# Altium schematic sheet extio.SchDoc
size A2
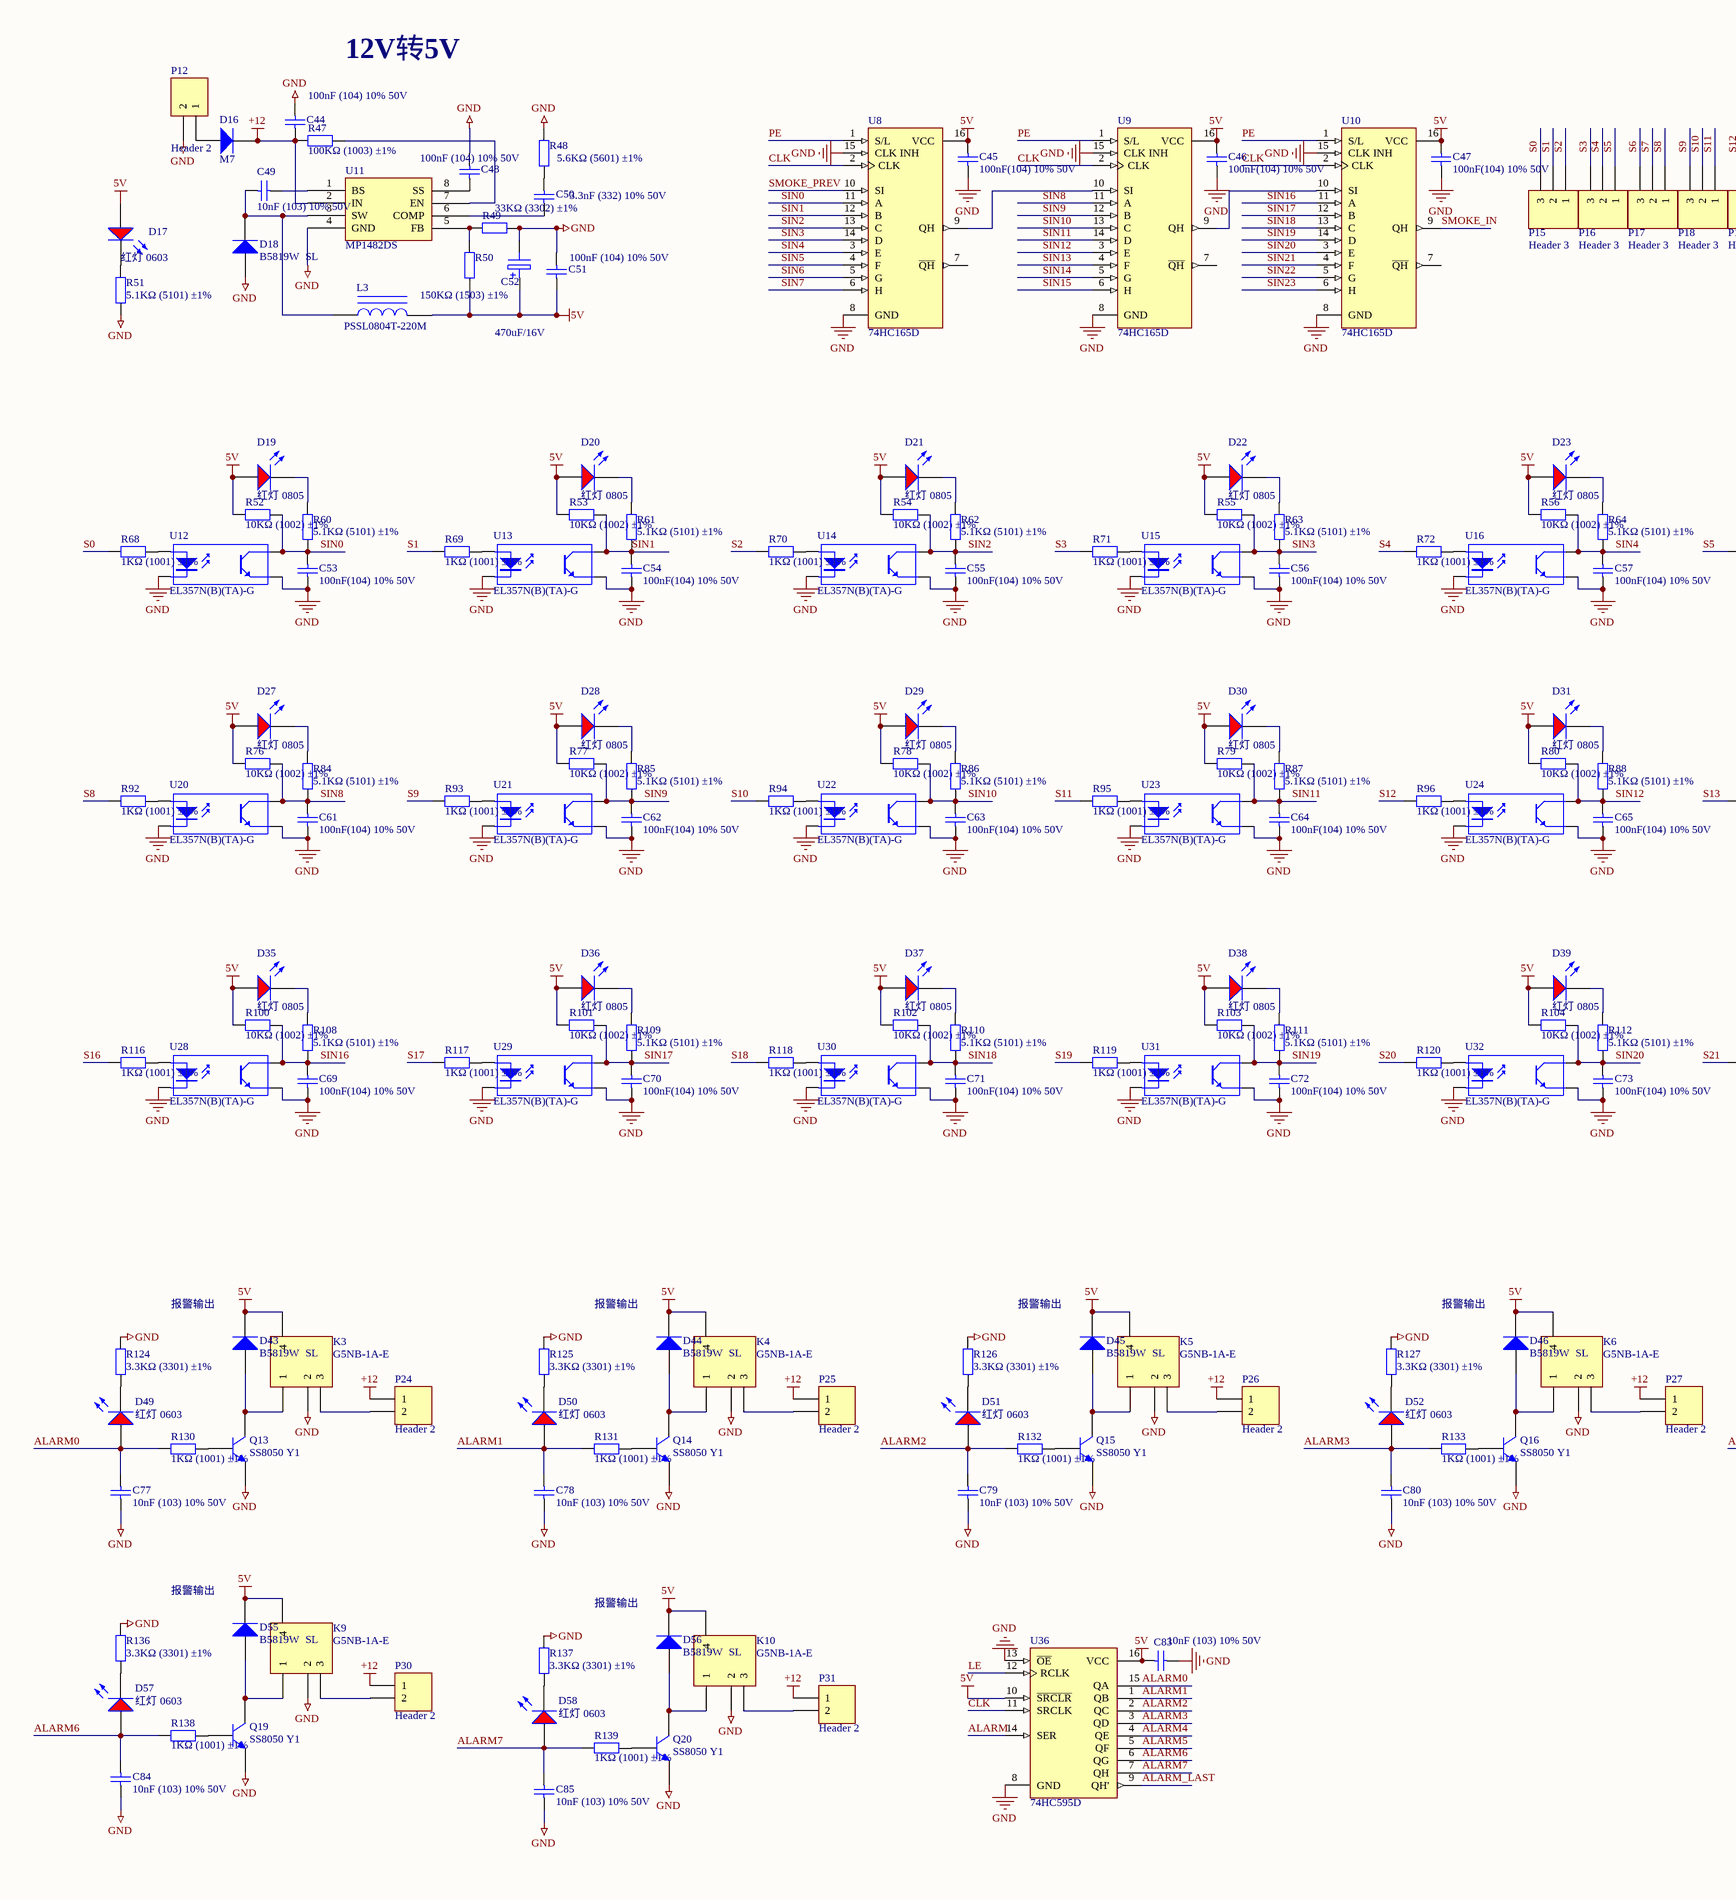
[diagram p0: extio.SchDoc, left]
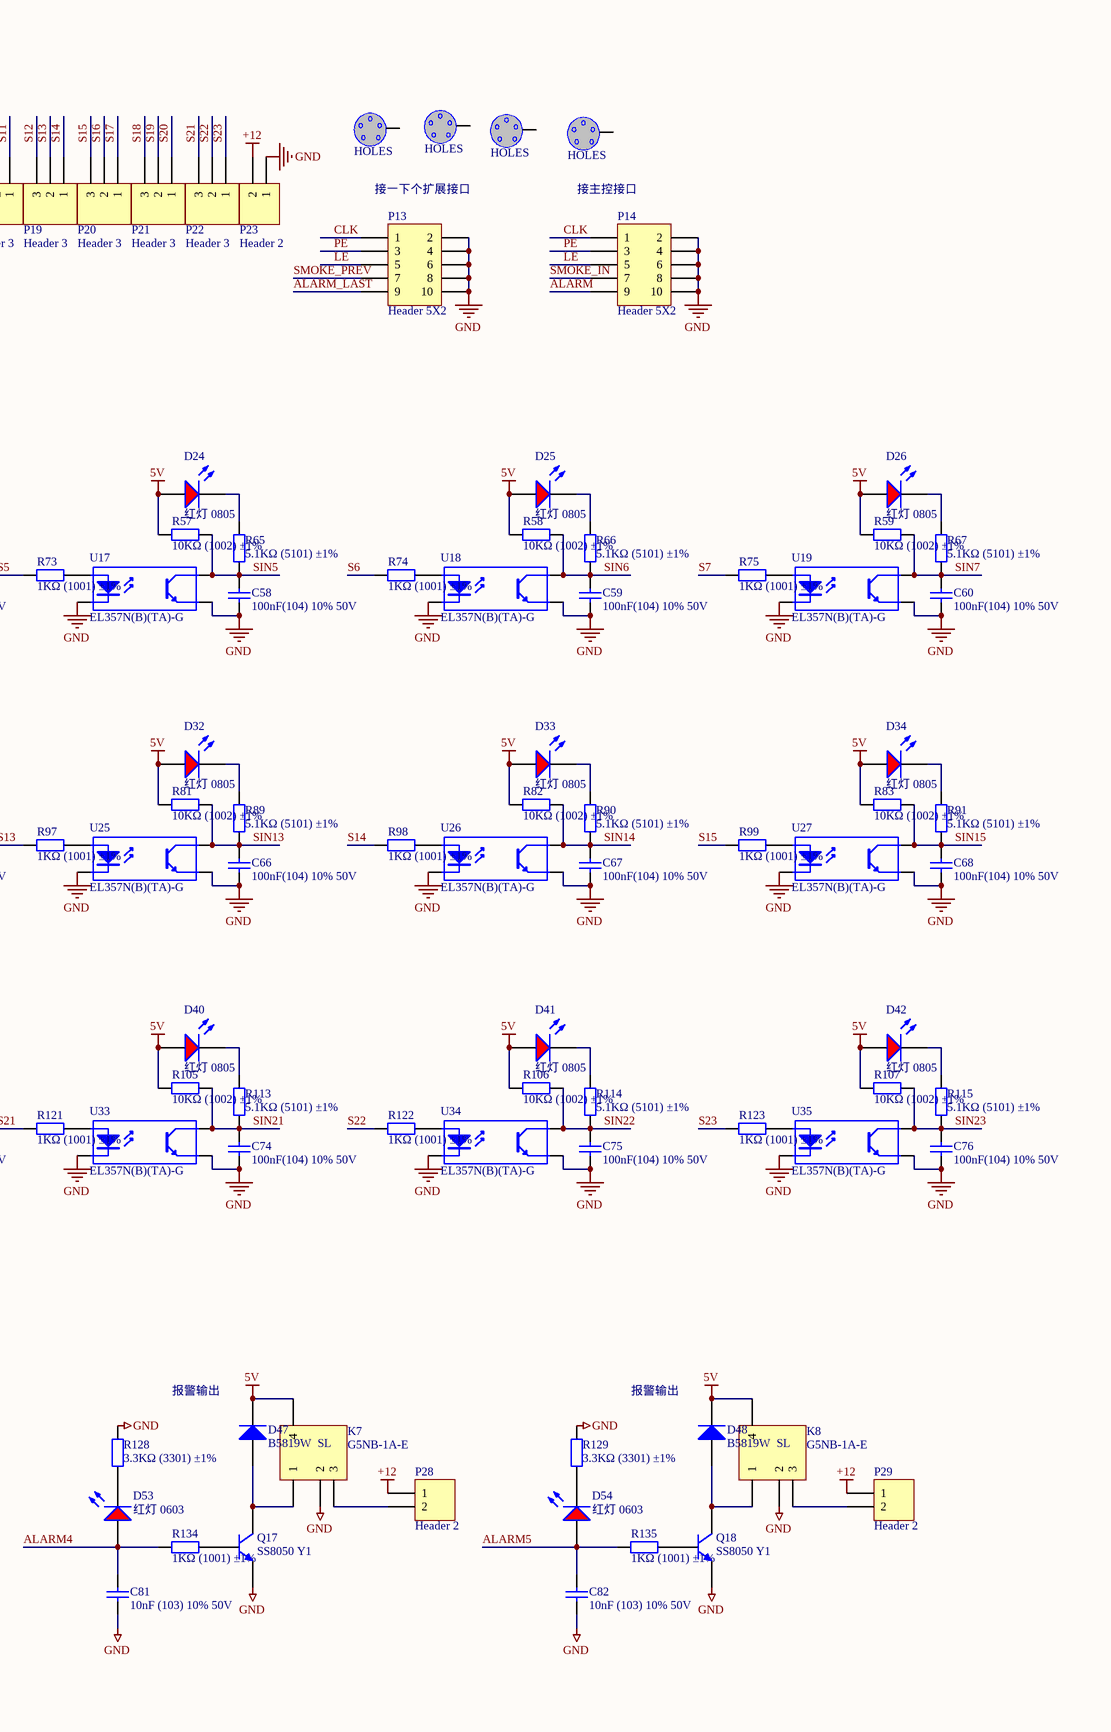
[diagram p1: extio.SchDoc, right]

## Parts
C44  100nF (104) 10% 50V  [0603_C]
C45  100nF(104) 10% 50V  [0805_C]
C46  100nF(104) 10% 50V  [0805_C]
C47  100nF(104) 10% 50V  [0805_C]
C48  100nF (104) 10% 50V  [0603_C]
C49  10nF (103) 10% 50V  [0603_C]
C50  3.3nF (332) 10% 50V  [0603_C]
C51  100nF (104) 10% 50V  [0603_C]
C52  470uF/16V  [153CLV-0810]
C53  100nF(104) 10% 50V  [0805_C]
C54  100nF(104) 10% 50V  [0805_C]
C55  100nF(104) 10% 50V  [0805_C]
C56  100nF(104) 10% 50V  [0805_C]
C57  100nF(104) 10% 50V  [0805_C]
C58  100nF(104) 10% 50V  [0805_C]
C59  100nF(104) 10% 50V  [0805_C]
C60  100nF(104) 10% 50V  [0805_C]
C61  100nF(104) 10% 50V  [0805_C]
C62  100nF(104) 10% 50V  [0805_C]
C63  100nF(104) 10% 50V  [0805_C]
C64  100nF(104) 10% 50V  [0805_C]
C65  100nF(104) 10% 50V  [0805_C]
C66  100nF(104) 10% 50V  [0805_C]
C67  100nF(104) 10% 50V  [0805_C]
C68  100nF(104) 10% 50V  [0805_C]
C69  100nF(104) 10% 50V  [0805_C]
C70  100nF(104) 10% 50V  [0805_C]
C71  100nF(104) 10% 50V  [0805_C]
C72  100nF(104) 10% 50V  [0805_C]
C73  100nF(104) 10% 50V  [0805_C]
C74  100nF(104) 10% 50V  [0805_C]
C75  100nF(104) 10% 50V  [0805_C]
C76  100nF(104) 10% 50V  [0805_C]
C77  10nF (103) 10% 50V  [0603_C]
C78  10nF (103) 10% 50V  [0603_C]
C79  10nF (103) 10% 50V  [0603_C]
C80  10nF (103) 10% 50V  [0603_C]
C81  10nF (103) 10% 50V  [0603_C]
C82  10nF (103) 10% 50V  [0603_C]
C83  10nF (103) 10% 50V  [0603_C]
C84  10nF (103) 10% 50V  [0603_C]
C85  10nF (103) 10% 50V  [0603_C]
D16  M7  [SMA(DO-214AC)_S1]
D17  红灯 0603  [0603_LED_S1]
D18  B5819W  SL  [SOD-123]
D19  红灯 0805  [0805_LED_S1]
D20  红灯 0805  [0805_LED_S1]
D21  红灯 0805  [0805_LED_S1]
D22  红灯 0805  [0805_LED_S1]
D23  红灯 0805  [0805_LED_S1]
D24  红灯 0805  [0805_LED_S1]
D25  红灯 0805  [0805_LED_S1]
D26  红灯 0805  [0805_LED_S1]
D27  红灯 0805  [0805_LED_S1]
D28  红灯 0805  [0805_LED_S1]
D29  红灯 0805  [0805_LED_S1]
D30  红灯 0805  [0805_LED_S1]
D31  红灯 0805  [0805_LED_S1]
D32  红灯 0805  [0805_LED_S1]
D33  红灯 0805  [0805_LED_S1]
D34  红灯 0805  [0805_LED_S1]
D35  红灯 0805  [0805_LED_S1]
D36  红灯 0805  [0805_LED_S1]
D37  红灯 0805  [0805_LED_S1]
D38  红灯 0805  [0805_LED_S1]
D39  红灯 0805  [0805_LED_S1]
D40  红灯 0805  [0805_LED_S1]
D41  红灯 0805  [0805_LED_S1]
D42  红灯 0805  [0805_LED_S1]
D43  B5819W  SL  [SOD-123]
D44  B5819W  SL  [SOD-123]
D45  B5819W  SL  [SOD-123]
D46  B5819W  SL  [SOD-123]
D47  B5819W  SL  [SOD-123]
D48  B5819W  SL  [SOD-123]
D49  红灯 0603  [0603_LED_S1]
D50  红灯 0603  [0603_LED_S1]
D51  红灯 0603  [0603_LED_S1]
D52  红灯 0603  [0603_LED_S1]
D53  红灯 0603  [0603_LED_S1]
D54  红灯 0603  [0603_LED_S1]
D55  B5819W  SL  [SOD-123]
D56  B5819W  SL  [SOD-123]
D57  红灯 0603  [0603_LED_S1]
D58  红灯 0603  [0603_LED_S1]
HOLES1  HOLES  [HOLES]
HOLES2  HOLES  [HOLES]
HOLES3  HOLES  [HOLES]
HOLES4  HOLES  [HOLES]
K3  G5NB-1A-E  [G5NB-1A]
K4  G5NB-1A-E  [G5NB-1A]
K5  G5NB-1A-E  [G5NB-1A]
K6  G5NB-1A-E  [G5NB-1A]
K7  G5NB-1A-E  [G5NB-1A]
K8  G5NB-1A-E  [G5NB-1A]
K9  G5NB-1A-E  [G5NB-1A]
K10  G5NB-1A-E  [G5NB-1A]
L3  PSSL0804T-220M  [L7-8]
P12  Header 2  [KF396-2P]
P13  Header 5X2  [ML10]
P14  Header 5X2  [ML10]
P15  Header 3  [KF396-3P]
P16  Header 3  [KF396-3P]
P17  Header 3  [KF396-3P]
P18  Header 3  [KF396-3P]
P19  Header 3  [KF396-3P]
P20  Header 3  [KF396-3P]
P21  Header 3  [KF396-3P]
P22  Header 3  [KF396-3P]
P23  Header 2  [KF396-2P]
P24  Header 2  [KF396-2P]
P25  Header 2  [KF396-2P]
P26  Header 2  [KF396-2P]
P27  Header 2  [KF396-2P]
P28  Header 2  [KF396-2P]
P29  Header 2  [KF396-2P]
P30  Header 2  [KF396-2P]
P31  Header 2  [KF396-2P]
Q13  SS8050 Y1  [SOT-23(SOT-23-3)]
Q14  SS8050 Y1  [SOT-23(SOT-23-3)]
Q15  SS8050 Y1  [SOT-23(SOT-23-3)]
Q16  SS8050 Y1  [SOT-23(SOT-23-3)]
Q17  SS8050 Y1  [SOT-23(SOT-23-3)]
Q18  SS8050 Y1  [SOT-23(SOT-23-3)]
Q19  SS8050 Y1  [SOT-23(SOT-23-3)]
Q20  SS8050 Y1  [SOT-23(SOT-23-3)]
R47  100KΩ (1003) ±1%  [0603_R]
R48  5.6KΩ (5601) ±1%  [0603_R]
R49  33KΩ (3302) ±1%  [0603_R]
R50  150KΩ (1503) ±1%  [0603_R]
R51  5.1KΩ (5101) ±1%  [0805_R]
R52  10KΩ (1002) ±1%  [0805_R]
R53  10KΩ (1002) ±1%  [0805_R]
R54  10KΩ (1002) ±1%  [0805_R]
R55  10KΩ (1002) ±1%  [0805_R]
R56  10KΩ (1002) ±1%  [0805_R]
R57  10KΩ (1002) ±1%  [0805_R]
R58  10KΩ (1002) ±1%  [0805_R]
R59  10KΩ (1002) ±1%  [0805_R]
R60  5.1KΩ (5101) ±1%  [0805_R]
R61  5.1KΩ (5101) ±1%  [0805_R]
R62  5.1KΩ (5101) ±1%  [0805_R]
R63  5.1KΩ (5101) ±1%  [0805_R]
R64  5.1KΩ (5101) ±1%  [0805_R]
R65  5.1KΩ (5101) ±1%  [0805_R]
R66  5.1KΩ (5101) ±1%  [0805_R]
R67  5.1KΩ (5101) ±1%  [0805_R]
R68  1KΩ (1001) ±1%  [0805_R]
R69  1KΩ (1001) ±1%  [0805_R]
R70  1KΩ (1001) ±1%  [0805_R]
R71  1KΩ (1001) ±1%  [0805_R]
R72  1KΩ (1001) ±1%  [0805_R]
R73  1KΩ (1001) ±1%  [0805_R]
R74  1KΩ (1001) ±1%  [0805_R]
R75  1KΩ (1001) ±1%  [0805_R]
R76  10KΩ (1002) ±1%  [0805_R]
R77  10KΩ (1002) ±1%  [0805_R]
R78  10KΩ (1002) ±1%  [0805_R]
R79  10KΩ (1002) ±1%  [0805_R]
R80  10KΩ (1002) ±1%  [0805_R]
R81  10KΩ (1002) ±1%  [0805_R]
R82  10KΩ (1002) ±1%  [0805_R]
R83  10KΩ (1002) ±1%  [0805_R]
R84  5.1KΩ (5101) ±1%  [0805_R]
R85  5.1KΩ (5101) ±1%  [0805_R]
R86  5.1KΩ (5101) ±1%  [0805_R]
R87  5.1KΩ (5101) ±1%  [0805_R]
R88  5.1KΩ (5101) ±1%  [0805_R]
R89  5.1KΩ (5101) ±1%  [0805_R]
R90  5.1KΩ (5101) ±1%  [0805_R]
R91  5.1KΩ (5101) ±1%  [0805_R]
R92  1KΩ (1001) ±1%  [0805_R]
R93  1KΩ (1001) ±1%  [0805_R]
R94  1KΩ (1001) ±1%  [0805_R]
R95  1KΩ (1001) ±1%  [0805_R]
R96  1KΩ (1001) ±1%  [0805_R]
R97  1KΩ (1001) ±1%  [0805_R]
R98  1KΩ (1001) ±1%  [0805_R]
R99  1KΩ (1001) ±1%  [0805_R]
R100  10KΩ (1002) ±1%  [0805_R]
R101  10KΩ (1002) ±1%  [0805_R]
R102  10KΩ (1002) ±1%  [0805_R]
R103  10KΩ (1002) ±1%  [0805_R]
R104  10KΩ (1002) ±1%  [0805_R]
R105  10KΩ (1002) ±1%  [0805_R]
R106  10KΩ (1002) ±1%  [0805_R]
R107  10KΩ (1002) ±1%  [0805_R]
R108  5.1KΩ (5101) ±1%  [0805_R]
R109  5.1KΩ (5101) ±1%  [0805_R]
R110  5.1KΩ (5101) ±1%  [0805_R]
R111  5.1KΩ (5101) ±1%  [0805_R]
R112  5.1KΩ (5101) ±1%  [0805_R]
R113  5.1KΩ (5101) ±1%  [0805_R]
R114  5.1KΩ (5101) ±1%  [0805_R]
R115  5.1KΩ (5101) ±1%  [0805_R]
R116  1KΩ (1001) ±1%  [0805_R]
R117  1KΩ (1001) ±1%  [0805_R]
R118  1KΩ (1001) ±1%  [0805_R]
R119  1KΩ (1001) ±1%  [0805_R]
R120  1KΩ (1001) ±1%  [0805_R]
R121  1KΩ (1001) ±1%  [0805_R]
R122  1KΩ (1001) ±1%  [0805_R]
R123  1KΩ (1001) ±1%  [0805_R]
R124  3.3KΩ (3301) ±1%  [0603_R]
R125  3.3KΩ (3301) ±1%  [0603_R]
R126  3.3KΩ (3301) ±1%  [0603_R]
R127  3.3KΩ (3301) ±1%  [0603_R]
R128  3.3KΩ (3301) ±1%  [0603_R]
R129  3.3KΩ (3301) ±1%  [0603_R]
R130  1KΩ (1001) ±1%  [0603_R]
R131  1KΩ (1001) ±1%  [0603_R]
R132  1KΩ (1001) ±1%  [0603_R]
R133  1KΩ (1001) ±1%  [0603_R]
R134  1KΩ (1001) ±1%  [0603_R]
R135  1KΩ (1001) ±1%  [0603_R]
R136  3.3KΩ (3301) ±1%  [0603_R]
R137  3.3KΩ (3301) ±1%  [0603_R]
R138  1KΩ (1001) ±1%  [0603_R]
R139  1KΩ (1001) ±1%  [0603_R]
U8  74HC165D  [SOIC-16_150mil]
U9  74HC165D  [SOIC-16_150mil]
U10  74HC165D  [SOIC-16_150mil]
U11  MP1482DS  [SOIC-8_150mil]
U12  EL357N(B)(TA)-G  [SOP-4_P2.54]
U13  EL357N(B)(TA)-G  [SOP-4_P2.54]
U14  EL357N(B)(TA)-G  [SOP-4_P2.54]
U15  EL357N(B)(TA)-G  [SOP-4_P2.54]
U16  EL357N(B)(TA)-G  [SOP-4_P2.54]
U17  EL357N(B)(TA)-G  [SOP-4_P2.54]
U18  EL357N(B)(TA)-G  [SOP-4_P2.54]
U19  EL357N(B)(TA)-G  [SOP-4_P2.54]
U20  EL357N(B)(TA)-G  [SOP-4_P2.54]
U21  EL357N(B)(TA)-G  [SOP-4_P2.54]
U22  EL357N(B)(TA)-G  [SOP-4_P2.54]
U23  EL357N(B)(TA)-G  [SOP-4_P2.54]
U24  EL357N(B)(TA)-G  [SOP-4_P2.54]
U25  EL357N(B)(TA)-G  [SOP-4_P2.54]
U26  EL357N(B)(TA)-G  [SOP-4_P2.54]
U27  EL357N(B)(TA)-G  [SOP-4_P2.54]
U28  EL357N(B)(TA)-G  [SOP-4_P2.54]
U29  EL357N(B)(TA)-G  [SOP-4_P2.54]
U30  EL357N(B)(TA)-G  [SOP-4_P2.54]
U31  EL357N(B)(TA)-G  [SOP-4_P2.54]
U32  EL357N(B)(TA)-G  [SOP-4_P2.54]
U33  EL357N(B)(TA)-G  [SOP-4_P2.54]
U34  EL357N(B)(TA)-G  [SOP-4_P2.54]
U35  EL357N(B)(TA)-G  [SOP-4_P2.54]
U36  74HC595D  [SOIC-16_150mil]

## Nets
5V: C45.1 C46.1 C47.1 C51.1 C52.1 C83.1 D17.A D19.A D20.A D21.A D22.A D23.A D24.A D25.A D26.A D27.A D28.A D29.A D30.A D31.A D32.A D33.A D34.A D35.A D36.A D37.A D38.A D39.A D40.A D41.A D42.A D43.2(K) D44.2(K) D45.2(K) D46.2(K) D47.2(K) D48.2(K) D55.2(K) D56.2(K) K3.4 K4.4 K5.4 K6.4 K7.4 K8.4 K9.4 K10.4 L3.2 R50.2 R52.2 R53.2 R54.2 R55.2 R56.2 R57.2 R58.2 R59.2 R76.2 R77.2 R78.2 R79.2 R80.2 R81.2 R82.2 R83.2 R100.2 R101.2 R102.2 R103.2 R104.2 R105.2 R106.2 R107.2 U8.16(VCC) U9.16(VCC) U10.16(VCC) U36.10(~{SRCLR}) U36.16(VCC)
+12: C44.2 D16.2(K) P23.2 P24.1 P25.1 P26.1 P27.1 P28.1 P29.1 P30.1 P31.1 R47.1 U11.2(IN)
GND: C44.1 C45.2 C46.2 C47.2 C48.1 C51.2 C52.2 C53.2 C54.2 C55.2 C56.2 C57.2 C58.2 C59.2 C60.2 C61.2 C62.2 C63.2 C64.2 C65.2 C66.2 C67.2 C68.2 C69.2 C70.2 C71.2 C72.2 C73.2 C74.2 C75.2 C76.2 C77.2 C78.2 C79.2 C80.2 C81.2 C82.2 C83.2 C84.2 C85.2 D18.1(A) K3.2 K4.2 K5.2 K6.2 K7.2 K8.2 K9.2 K10.2 P12.2 P13.2 P13.4 P13.6 P13.8 P13.10 P14.2 P14.4 P14.6 P14.8 P14.10 P23.1 Q13.2(E) Q14.2(E) Q15.2(E) Q16.2(E) Q17.2(E) Q18.2(E) Q19.2(E) Q20.2(E) R48.2 R49.2 R51.2 R124.1 R125.1 R126.1 R127.1 R128.1 R129.1 R136.1 R137.1 U8.8(GND) U8.15(CLK_INH) U9.8(GND) U9.15(CLK_INH) U10.8(GND) U10.15(CLK_INH) U11.4(GND) U12.2(K) U12.3(E) U13.2(K) U13.3(E) U14.2(K) U14.3(E) U15.2(K) U15.3(E) U16.2(K) U16.3(E) U17.2(K) U17.3(E) U18.2(K) U18.3(E) U19.2(K) U19.3(E) U20.2(K) U20.3(E) U21.2(K) U21.3(E) U22.2(K) U22.3(E) U23.2(K) U23.3(E) U24.2(K) U24.3(E) U25.2(K) U25.3(E) U26.2(K) U26.3(E) U27.2(K) U27.3(E) U28.2(K) U28.3(E) U29.2(K) U29.3(E) U30.2(K) U30.3(E) U31.2(K) U31.3(E) U32.2(K) U32.3(E) U33.2(K) U33.3(E) U34.2(K) U34.3(E) U35.2(K) U35.3(E) U36.8(GND) U36.13(~{OE})
ALARM: P14.9 U36.14(SER)
ALARM0: C77.1 D49.A R130.1 U36.15(QA)
ALARM1: C78.1 D50.A R131.1 U36.1(QB)
ALARM2: C79.1 D51.A R132.1 U36.2(QC)
ALARM3: C80.1 D52.A R133.1 U36.3(QD)
ALARM4: C81.1 D53.A R134.1 U36.4(QE)
ALARM5: C82.1 D54.A R135.1 U36.5(QF)
ALARM6: C84.1 D57.A R138.1 U36.6(QG)
ALARM7: C85.1 D58.A R139.1 U36.7(QH)
ALARM_LAST: P13.9 U36.9(QH')
CLK: P13.1 P14.1 U8.2(CLK) U9.2(CLK) U10.2(CLK) U36.11(SRCLK)
LE: P13.5 P14.5 U36.12(RCLK)
PE: P13.3 P14.3 U8.1(S/L) U9.1(S/L) U10.1(S/L)
S0: P15.3 R68.1
S1: P15.2 R69.1
S2: P15.1 R70.1
S3: P16.3 R71.1
S4: P16.2 R72.1
S5: P16.1 R73.1
S6: P17.3 R74.1
S7: P17.2 R75.1
S8: P17.1 R92.1
S9: P18.3 R93.1
S10: P18.2 R94.1
S11: P18.1 R95.1
S12: P19.3 R96.1
S13: P19.2 R97.1
S14: P19.1 R98.1
S15: P20.3 R99.1
S16: P20.2 R116.1
S17: P20.1 R117.1
S18: P21.3 R118.1
S19: P21.2 R119.1
S20: P21.1 R120.1
S21: P22.3 R121.1
S22: P22.2 R122.1
S23: P22.1 R123.1
SIN0: C53.1 R52.1 R60.2 U8.11(A) U12.4(C)
SIN1: C54.1 R53.1 R61.2 U8.12(B) U13.4(C)
SIN2: C55.1 R54.1 R62.2 U8.13(C) U14.4(C)
SIN3: C56.1 R55.1 R63.2 U8.14(D) U15.4(C)
SIN4: C57.1 R56.1 R64.2 U8.3(E) U16.4(C)
SIN5: C58.1 R57.1 R65.2 U8.4(F) U17.4(C)
SIN6: C59.1 R58.1 R66.2 U8.5(G) U18.4(C)
SIN7: C60.1 R59.1 R67.2 U8.6(H) U19.4(C)
SIN8: C61.1 R76.1 R84.2 U9.11(A) U20.4(C)
SIN9: C62.1 R77.1 R85.2 U9.12(B) U21.4(C)
SIN10: C63.1 R78.1 R86.2 U9.13(C) U22.4(C)
SIN11: C64.1 R79.1 R87.2 U9.14(D) U23.4(C)
SIN12: C65.1 R80.1 R88.2 U9.3(E) U24.4(C)
SIN13: C66.1 R81.1 R89.2 U9.4(F) U25.4(C)
SIN14: C67.1 R82.1 R90.2 U9.5(G) U26.4(C)
SIN15: C68.1 R83.1 R91.2 U9.6(H) U27.4(C)
SIN16: C69.1 R100.1 R108.2 U10.11(A) U28.4(C)
SIN17: C70.1 R101.1 R109.2 U10.12(B) U29.4(C)
SIN18: C71.1 R102.1 R110.2 U10.13(C) U30.4(C)
SIN19: C72.1 R103.1 R111.2 U10.14(D) U31.4(C)
SIN20: C73.1 R104.1 R112.2 U10.3(E) U32.4(C)
SIN21: C74.1 R105.1 R113.2 U10.4(F) U33.4(C)
SIN22: C75.1 R106.1 R114.2 U10.5(G) U34.4(C)
SIN23: C76.1 R107.1 R115.2 U10.6(H) U35.4(C)
SMOKE_IN: P14.7 U10.9(QH)
SMOKE_PREV: P13.7 U8.10(SI)
NetC48_2: C48.2 U11.8(SS)
NetC49_1: C49.1 D18.2(K) L3.1 U11.3(SW)
NetC49_2: C49.2 U11.1(BS)
NetC50_1: C50.1 R48.1
NetC50_2: C50.2 U11.6(COMP)
NetD16_1: D16.1(A) P12.1
NetD17_K: D17.K R51.1
NetD19_K: D19.K R60.1
NetD20_K: D20.K R61.1
NetD21_K: D21.K R62.1
NetD22_K: D22.K R63.1
NetD23_K: D23.K R64.1
NetD24_K: D24.K R65.1
NetD25_K: D25.K R66.1
NetD26_K: D26.K R67.1
NetD27_K: D27.K R84.1
NetD28_K: D28.K R85.1
NetD29_K: D29.K R86.1
NetD30_K: D30.K R87.1
NetD31_K: D31.K R88.1
NetD32_K: D32.K R89.1
NetD33_K: D33.K R90.1
NetD34_K: D34.K R91.1
NetD35_K: D35.K R108.1
NetD36_K: D36.K R109.1
NetD37_K: D37.K R110.1
NetD38_K: D38.K R111.1
NetD39_K: D39.K R112.1
NetD40_K: D40.K R113.1
NetD41_K: D41.K R114.1
NetD42_K: D42.K R115.1
NetD43_1: D43.1(A) K3.1 Q13.3(C)
NetD44_1: D44.1(A) K4.1 Q14.3(C)
NetD45_1: D45.1(A) K5.1 Q15.3(C)
NetD46_1: D46.1(A) K6.1 Q16.3(C)
NetD47_1: D47.1(A) K7.1 Q17.3(C)
NetD48_1: D48.1(A) K8.1 Q18.3(C)
NetD49_K: D49.K R124.2
NetD50_K: D50.K R125.2
NetD51_K: D51.K R126.2
NetD52_K: D52.K R127.2
NetD53_K: D53.K R128.2
NetD54_K: D54.K R129.2
NetD55_1: D55.1(A) K9.1 Q19.3(C)
NetD56_1: D56.1(A) K10.1 Q20.3(C)
NetD57_K: D57.K R136.2
NetD58_K: D58.K R137.2
NetK3_3: K3.3 P24.2
NetK4_3: K4.3 P25.2
NetK5_3: K5.3 P26.2
NetK6_3: K6.3 P27.2
NetK7_3: K7.3 P28.2
NetK8_3: K8.3 P29.2
NetK9_3: K9.3 P30.2
NetK10_3: K10.3 P31.2
NetQ13_1: Q13.1(B) R130.2
NetQ14_1: Q14.1(B) R131.2
NetQ15_1: Q15.1(B) R132.2
NetQ16_1: Q16.1(B) R133.2
NetQ17_1: Q17.1(B) R134.2
NetQ18_1: Q18.1(B) R135.2
NetQ19_1: Q19.1(B) R138.2
NetQ20_1: Q20.1(B) R139.2
NetR47_2: R47.2 U11.7(EN)
NetR49_1: R49.1 R50.1 U11.5(FB)
NetR68_2: R68.2 U12.1(A)
NetR69_2: R69.2 U13.1(A)
NetR70_2: R70.2 U14.1(A)
NetR71_2: R71.2 U15.1(A)
NetR72_2: R72.2 U16.1(A)
NetR73_2: R73.2 U17.1(A)
NetR74_2: R74.2 U18.1(A)
NetR75_2: R75.2 U19.1(A)
NetR92_2: R92.2 U20.1(A)
NetR93_2: R93.2 U21.1(A)
NetR94_2: R94.2 U22.1(A)
NetR95_2: R95.2 U23.1(A)
NetR96_2: R96.2 U24.1(A)
NetR97_2: R97.2 U25.1(A)
NetR98_2: R98.2 U26.1(A)
NetR99_2: R99.2 U27.1(A)
NetR116_2: R116.2 U28.1(A)
NetR117_2: R117.2 U29.1(A)
NetR118_2: R118.2 U30.1(A)
NetR119_2: R119.2 U31.1(A)
NetR120_2: R120.2 U32.1(A)
NetR121_2: R121.2 U33.1(A)
NetR122_2: R122.2 U34.1(A)
NetR123_2: R123.2 U35.1(A)
NetU8_9: U8.9(QH) U9.10(SI)
NetU9_9: U9.9(QH) U10.10(SI)

Not connected (* = marked no-connect by the designer): HOLES1 1; HOLES2 1; HOLES3 1; HOLES4 1; U8 7(~{QH}); U9 7(~{QH}); U10 7(~{QH})

## Notes on the sheet
- 12V转5V
- 接一下个扩展接口
- 接主控接口
- 报警输出

## Library data of the parts
C44 C48 C51 = 0603 100nF (104) 10% 50V: 贴片电容; ComponentLink1Description: 供应商链接; ComponentLink1URL: http://www.szlcsc.com/product/details_15331.html; Package: 0603; Supplier: LC; SuppliersPartNumber: C14663
C45-C47 C53-C76 = 0805 100nF(104) 10% 50V: 贴片电容; ComponentLink1Description: 供应商链接; ComponentLink1URL: http://www.szlcsc.com/product/details_50686.html; Package: 0805; Supplier: LC; SuppliersPartNumber: C49678
C49 C77-C85 = 0603 10nF (103) 10% 50V: 贴片电容; ComponentLink1Description: 供应商链接; ComponentLink1URL: http://www.szlcsc.com/product/details_58143.html; Package: 0603; Supplier: LC; SuppliersPartNumber: C57112
C50 = 0603 3.3nF (332) 10% 50V: 贴片电容; ComponentLink1Description: 供应商链接; ComponentLink1URL: http://www.szlcsc.com/product/details_1965.html; Package: 0603; Supplier: LC; SuppliersPartNumber: C1613
C52 = ELECTRO1: Electrolytic Capacitor
D16 = SMA(DO-214AC) M7: 二极管; Notepad: 1N4007 4007 编号C2464 已经停售, 使用新物料编号C95872; ComponentLink1Description: 供应商链接; ComponentLink1URL: http://www.szlcsc.com/product/details_2841.html; Package: SMA(DO-214AC); Supplier: LC; SuppliersPartNumber: C95872
D17 D49-D54 D57 D58 = 0603 红灯: 发光二极管; ComponentLink1Description: 供应商链接; ComponentLink1URL: http://www.szlcsc.com/product/details_2659.html; Package: 0603; Supplier: LC; SuppliersPartNumber: C2286
D18 D43-D48 D55 D56 = SOD-123 B5819W  SL: 肖特基二极管; ComponentLink1Description: 供应商链接; ComponentLink1URL: http://www.szlcsc.com/product/details_9093.html; Package: SOD-123; Supplier: LC; SuppliersPartNumber: C8598
D19-D42 = 0805 红灯: 发光二极管; ComponentLink1Description: 供应商链接; ComponentLink1URL: http://www.szlcsc.com/product/details_2668.html; Package: 0805; Supplier: LC; SuppliersPartNumber: C2295
HOLES1-HOLES4 = HOLES: holes for fastening
L3 = INDUCTOR IRON
P12 P23-P31 = Header 2: Header, 2-Pin; LatestRevisionDate: 17-Jul-2002; LatestRevisionNote: Re-released for DXP Platform.; Publisher: Altium Limited
P13 P14 = Header 5X2: Header, 5-Pin, Dual row; LatestRevisionDate: 17-Jul-2002; LatestRevisionNote: Re-released for DXP Platform.; Publisher: Altium Limited
P15-P22 = Header 3: Header, 3-Pin; LatestRevisionDate: 17-Jul-2002; LatestRevisionNote: Re-released for DXP Platform.; Publisher: Altium Limited
Q13-Q20 = SOT-23 SS8050 Y1: 三极管; ComponentLink1Description: 供应商链接; ComponentLink1URL: http://www.szlcsc.com/product/details_2507.html; Package: SOT-23; Supplier: LC; SuppliersPartNumber: C2150
R47 = 0603 100KΩ (1003) 1%: 贴片电阻; ComponentLink1Description: 供应商链接; ComponentLink1URL: http://www.szlcsc.com/product/details_26546.html; Package: 0603; Supplier: LC; SuppliersPartNumber: C25803
R48 = 0603 5.6KΩ (5601) 1%: 贴片电阻; ComponentLink1Description: 供应商链接; ComponentLink1URL: http://www.szlcsc.com/product/details_23916.html; Package: 0603; Supplier: LC; SuppliersPartNumber: C23189
R49 = 0603 33KΩ (3302) 1%: 贴片电阻; ComponentLink1Description: 供应商链接; ComponentLink1URL: http://www.szlcsc.com/product/details_4623.html; Package: 0603; Supplier: LC; SuppliersPartNumber: C4216
R50 = 0603 150KΩ (1503) 1%: 贴片电阻; ComponentLink1Description: 供应商链接; ComponentLink1URL: http://www.szlcsc.com/product/details_23534.html; Package: 0603; Supplier: LC; SuppliersPartNumber: C22807
R51 R60-R67 R84-R91 R108-R115 = 0805 5.1KΩ (5101) 1%: 贴片电阻; ComponentLink1Description: 供应商链接; ComponentLink1URL: http://www.szlcsc.com/product/details_28584.html; Package: 0805; Supplier: LC; SuppliersPartNumber: C27834
R52-R59 R76-R83 R100-R107 = 0805 10KΩ (1002) 1%: 贴片电阻; ComponentLink1Description: 供应商链接; ComponentLink1URL: http://www.szlcsc.com/product/details_18102.html; Package: 0805; Supplier: LC; SuppliersPartNumber: C17414
R68-R75 R92-R99 R116-R123 = 0805 1KΩ (1001) 1%: 贴片电阻; ComponentLink1Description: 供应商链接; ComponentLink1URL: http://www.szlcsc.com/product/details_18201.html; Package: 0805; Supplier: LC; SuppliersPartNumber: C17513
R124-R129 R136 R137 = 0603 3.3KΩ (3301) 1%: 贴片电阻; ComponentLink1Description: 供应商链接; ComponentLink1URL: http://www.szlcsc.com/product/details_23705.html; Package: 0603; Supplier: LC; SuppliersPartNumber: C22978
R130-R135 R138 R139 = 0603 1KΩ (1001) 1%: 贴片电阻; ComponentLink1Description: 供应商链接; ComponentLink1URL: http://www.szlcsc.com/product/details_21904.html; Package: 0603; Supplier: LC; SuppliersPartNumber: C21190
U8-U10 = 74HC165D_[C5613]: 74系列逻辑芯片; ComponentLink1Description: 供应商链接; ComponentLink1URL: http://www.szlcsc.com/product/details_6064.html; Package: SOIC-16_150mil; Supplier: LC; SuppliersPartNumber: C5613
U11 = MP1482DS_[C14867]: 电源芯片; ComponentLink1Description: 供应商链接; ComponentLink1URL: http://www.szlcsc.com/product/details_15539.html; Package: SOIC-8_150mil; Supplier: LC; SuppliersPartNumber: C14867
U12-U35 = EL357N(B)(TA)-G_[C6649]: 贴片光耦; ComponentLink1Description: 供应商链接; ComponentLink1URL: http://www.szlcsc.com/product/details_7114.html; Package: SOP-4_P2.54; Supplier: LC; SuppliersPartNumber: C6649
U36 = 74HC595D_[C5947]: 74系列逻辑芯片; ComponentLink1Description: 供应商链接; ComponentLink1URL: http://www.szlcsc.com/product/details_6413.html; Package: SOIC-16_150mil; Supplier: LC; SuppliersPartNumber: C5947